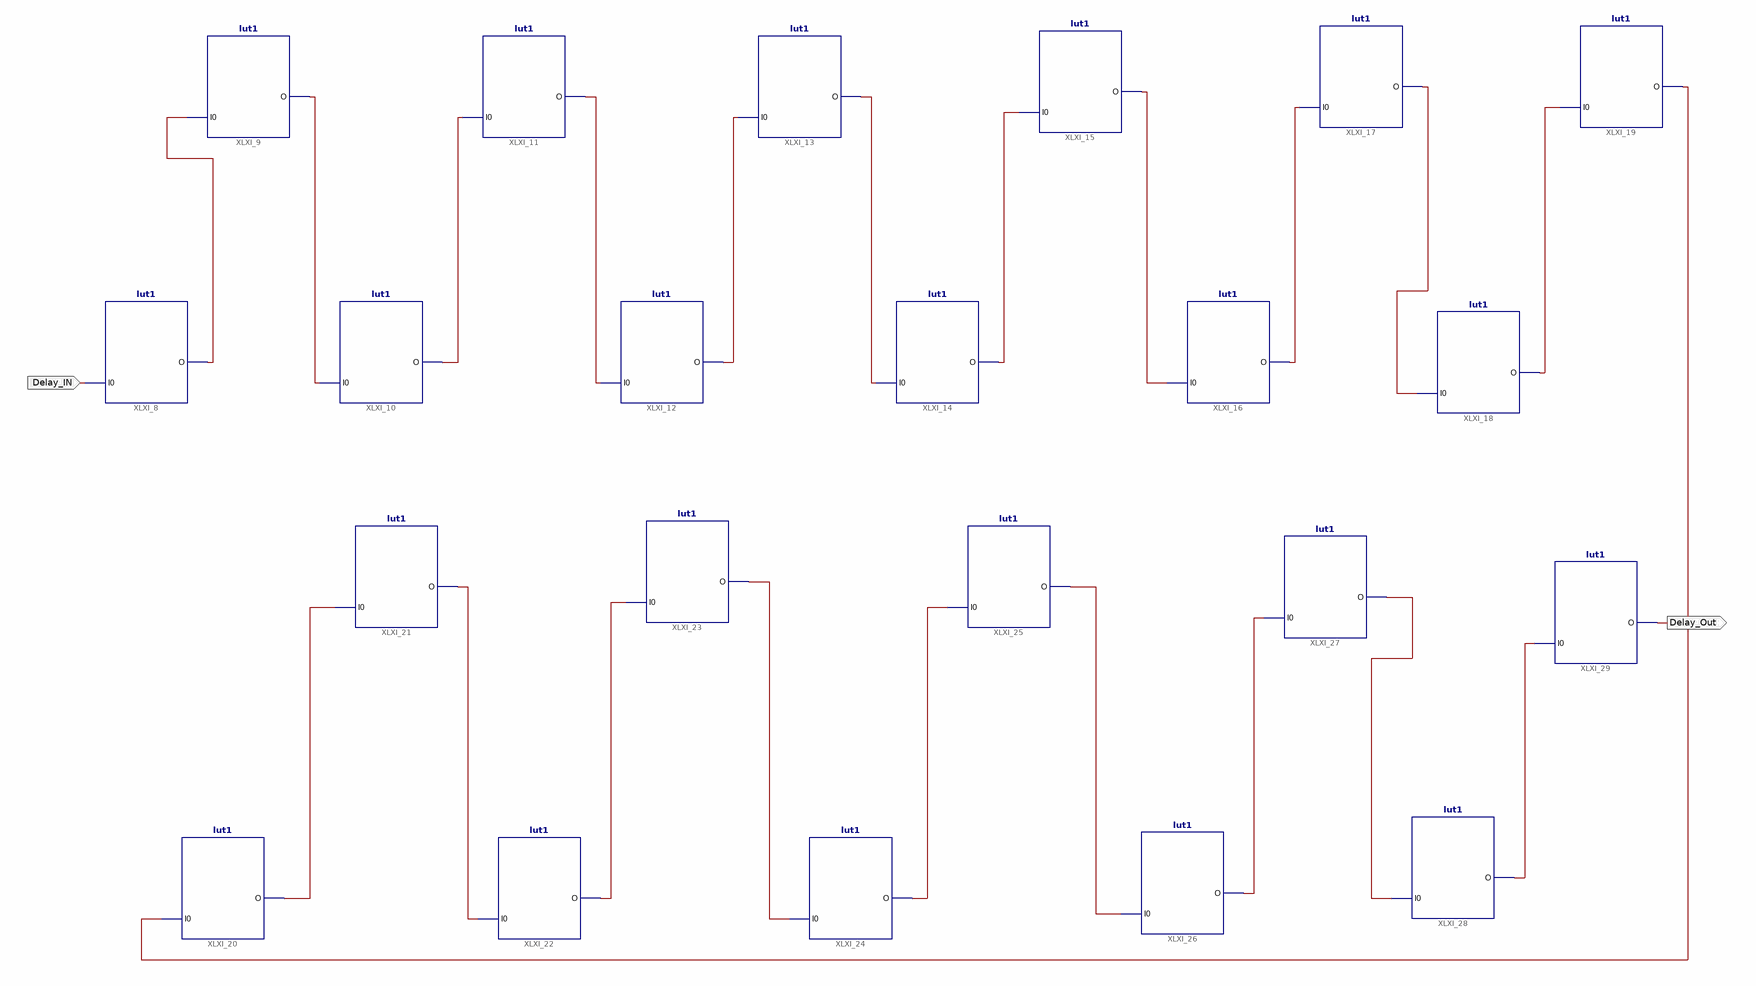
[diagram p0: schematic sheet 1]
// Xilinx ISE schematic AnalogDelayLine.sch (virtex4) as structural Verilog: 22 symbols, 2 ports
module AnalogDelayLine (
  input  Delay_IN,
  output Delay_Out
);

  wire XLXN_7, XLXN_23, XLXN_25, XLXN_27, XLXN_29, XLXN_31, XLXN_32, XLXN_33, XLXN_47, XLXN_48, XLXN_49,
       XLXN_50, XLXN_58, XLXN_59, XLXN_60, XLXN_61, XLXN_62, XLXN_63, XLXN_64, XLXN_66, XLXN_67;

  lut1 #(.INIT("2"), .LOC("SLICE_X0Y0"), .KEEP("true")) XLXI_8 (.I0(Delay_IN), .O(XLXN_7));
  lut1 #(.INIT("2"), .LOC("SLICE_X0Y254"), .KEEP("true")) XLXI_9 (.I0(XLXN_7), .O(XLXN_23));
  lut1 #(.INIT("2"), .LOC("SLICE_X0Y0"), .KEEP("true")) XLXI_10 (.I0(XLXN_23), .O(XLXN_25));
  lut1 #(.INIT("2"), .LOC("SLICE_X0Y254"), .KEEP("true")) XLXI_11 (.I0(XLXN_25), .O(XLXN_27));
  lut1 #(.INIT("2"), .LOC("SLICE_X0Y1"), .KEEP("true")) XLXI_12 (.I0(XLXN_27), .O(XLXN_29));
  lut1 #(.INIT("2"), .LOC("SLICE_X0Y255"), .KEEP("true")) XLXI_13 (.I0(XLXN_29), .O(XLXN_31));
  lut1 #(.INIT("2"), .LOC("SLICE_X0Y1"), .KEEP("true")) XLXI_14 (.I0(XLXN_31), .O(XLXN_32));
  lut1 #(.INIT("2"), .LOC("SLICE_X0Y255"), .KEEP("true")) XLXI_15 (.I0(XLXN_32), .O(XLXN_33));
  lut1 #(.INIT("2"), .LOC("SLICE_X1Y0"), .KEEP("true")) XLXI_16 (.I0(XLXN_33), .O(XLXN_47));
  lut1 #(.INIT("2"), .LOC("SLICE_X1Y254"), .KEEP("true")) XLXI_17 (.I0(XLXN_47), .O(XLXN_48));
  lut1 #(.INIT("2"), .LOC("SLICE_X1Y0"), .KEEP("true")) XLXI_18 (.I0(XLXN_48), .O(XLXN_49));
  lut1 #(.INIT("2"), .LOC("SLICE_X1Y254"), .KEEP("true")) XLXI_19 (.I0(XLXN_49), .O(XLXN_50));
  lut1 #(.INIT("2"), .LOC("SLICE_X1Y1"), .KEEP("true")) XLXI_20 (.I0(XLXN_50), .O(XLXN_58));
  lut1 #(.INIT("2"), .LOC("SLICE_X1Y255"), .KEEP("true")) XLXI_21 (.I0(XLXN_58), .O(XLXN_59));
  lut1 #(.INIT("2"), .LOC("SLICE_X1Y1"), .KEEP("true")) XLXI_22 (.I0(XLXN_59), .O(XLXN_60));
  lut1 #(.INIT("2"), .LOC("SLICE_X1Y255"), .KEEP("true")) XLXI_23 (.I0(XLXN_60), .O(XLXN_61));
  lut1 #(.INIT("2"), .LOC("SLICE_X2Y0"), .KEEP("true")) XLXI_24 (.I0(XLXN_61), .O(XLXN_62));
  lut1 #(.INIT("2"), .LOC("SLICE_X2Y254"), .KEEP("true")) XLXI_25 (.I0(XLXN_62), .O(XLXN_63));
  lut1 #(.INIT("2"), .LOC("SLICE_X2Y0"), .KEEP("true")) XLXI_26 (.I0(XLXN_63), .O(XLXN_64));
  lut1 #(.INIT("2"), .LOC("SLICE_X2Y254"), .KEEP("true")) XLXI_27 (.I0(XLXN_64), .O(XLXN_66));
  lut1 #(.INIT("2"), .LOC("SLICE_X2Y1"), .KEEP("true")) XLXI_28 (.I0(XLXN_66), .O(XLXN_67));
  lut1 #(.INIT("2"), .LOC("SLICE_X2Y255"), .KEEP("true")) XLXI_29 (.I0(XLXN_67), .O(Delay_Out));

  // Notes on the sheet:
  //   KEEP on signal XLXN_7 = TRUE
  //   KEEP on signal XLXN_23 = TRUE
  //   KEEP on signal XLXN_25 = TRUE
  //   KEEP on signal XLXN_27 = TRUE
  //   KEEP on signal XLXN_29 = TRUE
  //   KEEP on signal XLXN_31 = TRUE
  //   KEEP on signal XLXN_32 = TRUE
  //   KEEP on signal XLXN_33 = TRUE
  //   KEEP on signal XLXN_47 = TRUE
  //   KEEP on signal XLXN_48 = TRUE
  //   KEEP on signal XLXN_49 = TRUE
  //   KEEP on signal XLXN_50 = TRUE
endmodule
